# Altium schematic sheet scb.SchDoc
size A4
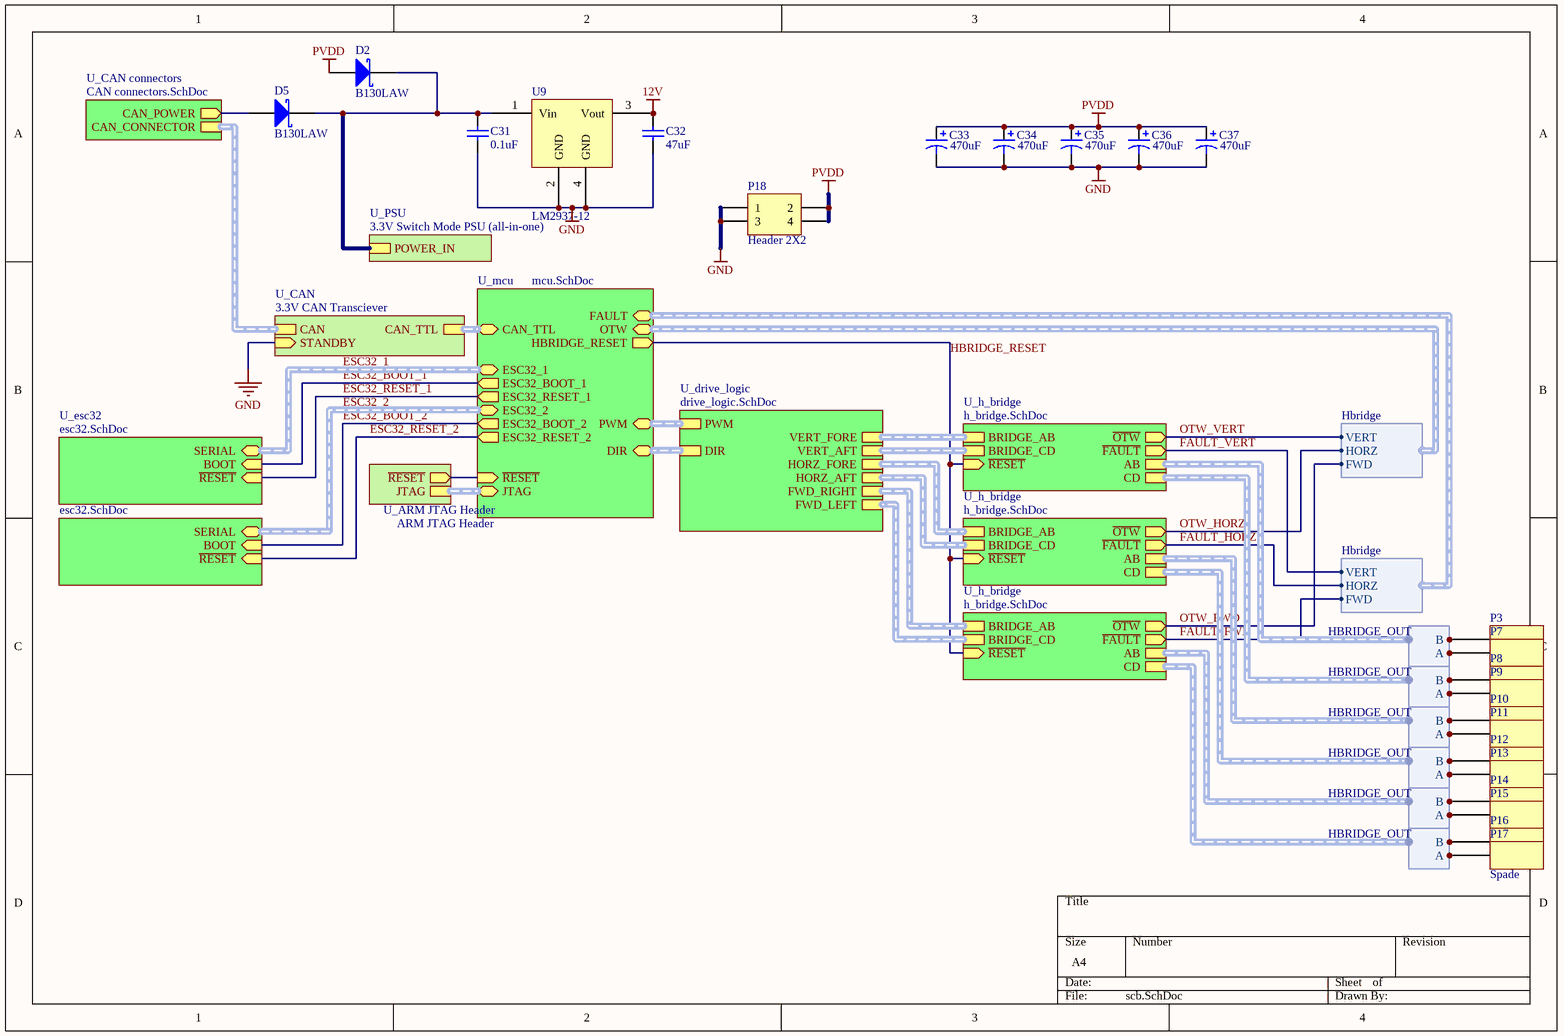
[diagram p0: scb.SchDoc]

## Parts
C31  value 0.1uF  [C0603]  (hidden comment: Cap)
C32  value 47uF  [C0805]  (hidden comment: Cap)
C33  value 470uF  [8mm SMD Can]  (hidden comment: Cap Pol1)
C34  value 470uF  [8mm SMD Can]  (hidden comment: Cap Pol1)
C35  value 470uF  [8mm SMD Can]  (hidden comment: Cap Pol1)
C36  value 470uF  [8mm SMD Can]  (hidden comment: Cap Pol1)
C37  value 470uF  [8mm SMD Can]  (hidden comment: Cap Pol1)
D2  B130LAW  [SOD-123]
D5  B130LAW  [SOD-123]
P3  Spade  [3866A]
P7  Spade  [3866A]
P8  Spade  [3866A]
P9  Spade  [3866A]
P10  Spade  [3866A]
P11  Spade  [3866A]
P12  Spade  [3866A]
P13  Spade  [3866A]
P14  Spade  [3866A]
P15  Spade  [3866A]
P16  Spade  [3866A]
P17  Spade  [3866A]
P18  Header 2X2  [39-28-1043]
U9  LM2937-12  [SOT230P700X180-4N]

## Sub-sheets
U_ARM JTAG Header = ARM JTAG Header: JTAG (harness ARM_JTAG), ~{RESET} (out)
U_CAN = 3.3V CAN Transciever: CAN_TTL (harness CAN_TTL), CAN (harness CAN), STANDBY (in)
U_CAN connectors = CAN connectors.SchDoc: CAN_CONNECTOR (harness CAN), CAN_POWER (out)
U_drive_logic = drive_logic.SchDoc: PWM (harness Thrusters), DIR (harness Thrusters), VERT_FORE (harness HBRIDGE_OUT), VERT_AFT (harness HBRIDGE_OUT), HORZ_FORE (harness HBRIDGE_OUT), HORZ_AFT (harness HBRIDGE_OUT), FWD_RIGHT (harness HBRIDGE_OUT), FWD_LEFT (harness HBRIDGE_OUT)
U_esc32 = esc32.SchDoc: SERIAL (harness SERIAL), BOOT (in), ~{RESET} (in)
U_esc32 = esc32.SchDoc: SERIAL (harness SERIAL), BOOT (in), ~{RESET} (in)
U_h_bridge = h_bridge.SchDoc: BRIDGE_AB (harness HBRIDGE_OUT), BRIDGE_CD (harness HBRIDGE_OUT), AB (harness HBRIDGE_OUT), CD (harness HBRIDGE_OUT), ~{OTW} (out), ~{FAULT} (out), ~{RESET} (in)
U_h_bridge = h_bridge.SchDoc: BRIDGE_AB (harness HBRIDGE_OUT), BRIDGE_CD (harness HBRIDGE_OUT), AB (harness HBRIDGE_OUT), CD (harness HBRIDGE_OUT), ~{OTW} (out), ~{FAULT} (out), ~{RESET} (in)
U_h_bridge = h_bridge.SchDoc: BRIDGE_AB (harness HBRIDGE_OUT), BRIDGE_CD (harness HBRIDGE_OUT), AB (harness HBRIDGE_OUT), CD (harness HBRIDGE_OUT), ~{OTW} (out), ~{FAULT} (out), ~{RESET} (in)
U_mcu = mcu.SchDoc: CAN_TTL (harness CAN_TTL), ~{RESET} (in), JTAG (harness ARM_JTAG), PWM (harness Thrusters), DIR (harness Thrusters), FAULT (harness Hbridge), OTW (harness Hbridge), HBRIDGE_RESET (out), ESC32_1 (harness SERIAL), ESC32_2 (harness SERIAL), ESC32_BOOT_1 (out), ESC32_BOOT_2 (out), ESC32_RESET_1 (out), ESC32_RESET_2 (out)
U_PSU = 3.3V Switch Mode PSU (all-in-one): POWER_IN

## Harnesses
Hbridge: FWD, HORZ, VERT
HBRIDGE_OUT: A, B

## Nets
12V: C32.1 U9.3(Vout)
GND: C31.2 C32.2 C33.2 C34.2 C35.2 C36.2 C37.2 P18.1 P18.3 U9.2(GND) U9.4(GND) ; sheet U_CAN/STANDBY
PVDD: C33.1 C34.1 C35.1 C36.1 C37.1 D2.1(A) P18.2 P18.4
ESC32_BOOT_1: sheet U_mcu/ESC32_BOOT_1, sheet U_esc32/BOOT
ESC32_BOOT_2: sheet U_mcu/ESC32_BOOT_2, sheet U_esc32/BOOT
ESC32_RESET_1: sheet U_mcu/ESC32_RESET_1, sheet U_esc32/~{RESET}
ESC32_RESET_2: sheet U_mcu/ESC32_RESET_2, sheet U_esc32/~{RESET}
FAULT_FWD: sheet U_h_bridge/~{FAULT}, sheet U_mcu/FAULT.FWD
FAULT_HORZ: sheet U_h_bridge/~{FAULT}, sheet U_mcu/FAULT.HORZ
FAULT_VERT: sheet U_h_bridge/~{FAULT}, sheet U_mcu/FAULT.VERT
HBRIDGE_RESET: sheet U_mcu/HBRIDGE_RESET, sheet U_h_bridge/~{RESET}, sheet U_h_bridge/~{RESET}, sheet U_h_bridge/~{RESET}
OTW_FWD: sheet U_h_bridge/~{OTW}, sheet U_mcu/OTW.FWD
OTW_HORZ: sheet U_h_bridge/~{OTW}, sheet U_mcu/OTW.HORZ
OTW_VERT: sheet U_h_bridge/~{OTW}, sheet U_mcu/OTW.VERT
NetC31_1: C31.1 D2.2(K) D5.2(K) U9.1(Vin) ; sheet U_PSU/POWER_IN
NetD5_1: D5.1(A) ; sheet U_CAN connectors/CAN_POWER
NetP3_1: P3.1 P3.2 ; sheet U_h_bridge/AB.B
NetP7_1: P7.1 P7.2 ; sheet U_h_bridge/AB.A
NetP8_1: P8.1 P8.2 ; sheet U_h_bridge/CD.B
NetP9_1: P9.1 P9.2 ; sheet U_h_bridge/CD.A
NetP10_1: P10.1 P10.2 ; sheet U_h_bridge/AB.B
NetP11_1: P11.1 P11.2 ; sheet U_h_bridge/AB.A
NetP12_1: P12.1 P12.2 ; sheet U_h_bridge/CD.B
NetP13_1: P13.1 P13.2 ; sheet U_h_bridge/CD.A
NetP14_1: P14.1 P14.2 ; sheet U_h_bridge/AB.B
NetP15_1: P15.1 P15.2 ; sheet U_h_bridge/AB.A
NetP16_1: P16.1 P16.2 ; sheet U_h_bridge/CD.B
NetP17_1: P17.1 P17.2 ; sheet U_h_bridge/CD.A
(unnamed): sheet U_mcu/~{RESET}, sheet U_ARM JTAG Header/~{RESET}

## Buses and harness runs
harness ESC32_1 = sheet U_esc32/SERIAL = sheet U_mcu/ESC32_1
harness ESC32_2 = sheet U_esc32/SERIAL = sheet U_mcu/ESC32_2
harness sheet U_ARM JTAG Header/JTAG = sheet U_mcu/JTAG
harness sheet U_CAN connectors/CAN_CONNECTOR = sheet U_CAN/CAN
harness sheet U_CAN/CAN_TTL = sheet U_mcu/CAN_TTL
harness sheet U_drive_logic/DIR = sheet U_mcu/DIR
harness sheet U_drive_logic/FWD_LEFT = sheet U_h_bridge/BRIDGE_CD
harness sheet U_drive_logic/FWD_RIGHT = sheet U_h_bridge/BRIDGE_AB
harness sheet U_drive_logic/HORZ_AFT = sheet U_h_bridge/BRIDGE_CD
harness sheet U_drive_logic/HORZ_FORE = sheet U_h_bridge/BRIDGE_AB
harness sheet U_drive_logic/PWM = sheet U_mcu/PWM
harness sheet U_drive_logic/VERT_AFT = sheet U_h_bridge/BRIDGE_CD
harness sheet U_drive_logic/VERT_FORE = sheet U_h_bridge/BRIDGE_AB

## Library data of the parts
C31 C32 = Cap: Capacitor
  C31: farnell: 9406140
C33-C37 = Cap Pol1: Polarized Capacitor (Radial); Published: 8-Jun-2000; LatestRevisionDate: 17-Jul-2002; LatestRevisionNote: Re-released for DXP Platform.; PackageReference: RB7.6-15; Publisher: Altium Limited; PackageDescription: Polarized Capacitor (Radial); 2 Leads; farnell: 1868411
D2 D5 = D Schottky: Schottky Diode; Published: 8-Jun-2000; LatestRevisionDate: 17-Jul-2002; LatestRevisionNote: Re-released for DXP Platform.; PackageReference: SMB; Publisher: Altium Limited; PackageDescription: DO-214-AA/SMB; 2 C-Bend Leads; Body 5.3 x 3.6 mm, inc. leads (LxW); Code_JEDEC: DO-214-AA; farnell: 1858617
P3 P7-P17 = 3866A: Space connector; Farnell PN: 3625588
P18 = Header 2X2: Header, 2-Pin, Dual row; LatestRevisionDate: 17-Jul-2002; LatestRevisionNote: Re-released for DXP Platform.; Publisher: Altium Limited
U9 = LM2937